# Altium project Line Coding Transceiver_Decoder.PrjPcb
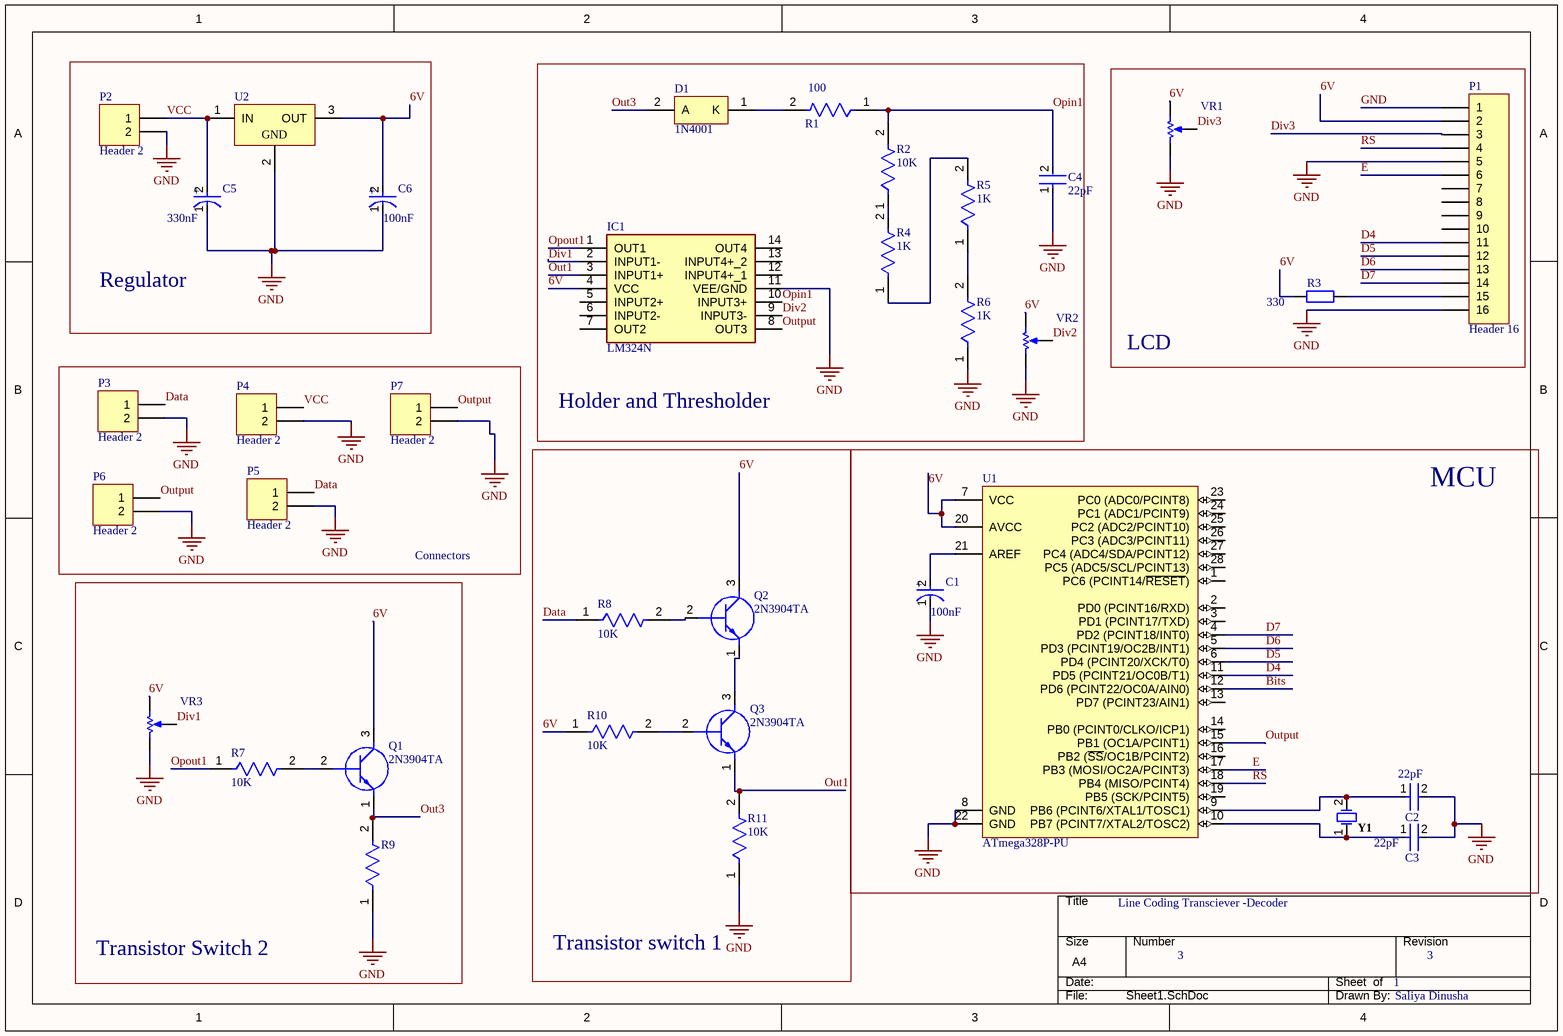
[diagram p0: Sheet1.SchDoc]
1 sheet, 35 parts. Net scope: global (net labels, ports and power ports of the same name join across sheets).
Board file: PCB1.PcbDoc

## Sheet Sheet1.SchDoc: Line Coding Transciever -Decoder
size A4; Author: Saliya Dinusha; SheetNumber: 1; SheetTotal: 1; Project: Line Coding Transciever; RevNumber: 3; VerNumber: 3

### Parts
C1  Capacitance: 100nF  [FP-UVR2AR22MDD1TD-MFG]  (hidden comment: UVR2AR22MDD1TD)
C2  22pF  [FP-RDE0M1-MFG]
C3  22pF  [FP-RDE0M1-MFG]
C4  22pF  [FP-RDE0M1-MFG]
C5  Capacitance: 330nF  [FP-UVR2AR22MDD1TD-MFG]  (hidden comment: UVR2AR22MDD1TD)
C6  Capacitance: 100nF  [FP-UVR2AR22MDD1TD-MFG]  (hidden comment: UVR2AR22MDD1TD)
D1  1N4001  [ONSC-AXIAL_LEAD-2-59-10_P]
IC1  LM324N  [DIP794W56P254L1918H533Q14N]
P1  Header 16  [HDR1X16]
P2  Header 2  [HDR1X2]
P3  Header 2  [HDR1X2]
P4  Header 2  [HDR1X2]
P5  Header 2  [HDR1X2]
P6  Header 2  [HDR1X2]
P7  Header 2  [HDR1X2]
Q1  2N3904TA  [BC33740TA]
Q2  2N3904TA  [BC33740TA]
Q3  2N3904TA  [BC33740TA]
R1  100  [FP-MFR-25-MFG]
R2  10K  [FP-MFR-25-MFG]
R3  value 330  [AXIAL-0.4]  (hidden comment: Res2)
R4  1K  [FP-MFR-25-MFG]
R5  1K  [FP-MFR-25-MFG]
R6  1K  [FP-MFR-25-MFG]
R7  10K  [FP-MFR-25-MFG]
R8  10K  [FP-MFR-25-MFG]
R9  10K  [FP-MFR-25-MFG]  (value not drawn)
R10  10K  [FP-MFR-25-MFG]
R11  10K  [FP-MFR-25-MFG]
U1  ATmega328P-PU  [28P3]
U2  L7805CV  [TO220]  (value not drawn)
VR1  3362P-1-103LF  [BOUR-3362P]  (value not drawn)
VR2  3362P-1-103LF  [BOUR-3362P]  (value not drawn)
VR3  3362P-1-103LF  [BOUR-3362P]  (value not drawn)
Y1  FOXSLF/120-20  [FOX-FOXSLF-2_V]  (value not drawn)

### Blocks framed on the sheet
Regulator: C5 C6 P2 U2
Holder and Thresholder: C4 D1 IC1 R1 R2 R4-R6 VR2
LCD: P1 R3 VR1
Connectors: P3-P7
Transistor switch 1: Q2 Q3 R8 R10 R11
MCU: C1-C3 U1 Y1
Transistor Switch 2: Q1 R7 R9 VR3

### Nets
GND: C1.1(C) C2.2 C3.2 C4.1 C5.1(C) C6.1(C) IC1.11(VEE/GND) P1.1 P1.5 P1.16 P2.2 P3.2 P4.2 P5.2 P6.2 P7.2 R6.1 R9.1 R11.1 U1.8(GND) U1.22(GND) U2.2(GND) VR1.3(CW) VR2.3(CW) VR3.3(CW)
6V: C6.2(A) IC1.4(VCC) P1.2 Q1.3(C) Q2.3(C) R3.1 R10.1 U1.7(VCC) U1.20(AVCC) U2.3(OUT) VR1.1(CCW) VR2.1(CCW) VR3.1(CCW)
Bits: U1.12(PD6_(PCINT22/OC0A/AIN0))
D4: P1.11 U1.11(PD5_(PCINT21/OC0B/T1))
D5: P1.12 U1.6(PD4_(PCINT20/XCK/T0))
D6: P1.13 U1.5(PD3_(PCINT19/OC2B/INT1))
D7: P1.14 U1.4(PD2_(PCINT18/INT0))
Data: P3.1 P5.1 R8.1
Div1: IC1.2(INPUT1-) VR3.2(S)
Div2: IC1.9(INPUT3-) VR2.2(S)
Div3: P1.3 VR1.2(S)
E: P1.6 U1.17(PB3_(MOSI/OC2A/PCINT3))
Opin1: C4.2 IC1.10(INPUT3+) R1.1 R2.2
Opout1: IC1.1(OUT1) R7.1
Out1: IC1.3(INPUT1+) Q3.1(E) R11.2
Out3: D1.2(A) Q1.1(E) R9.2
Output: IC1.8(OUT3) P6.1 P7.1 U1.15(PB1_(OC1A/PCINT1))
RS: P1.4 U1.18(PB4_(MISO/PCINT4))
VCC: C5.2(A) P2.1 P4.1 U2.1(IN)
NetC1_2: C1.2(A) U1.21(AREF)
NetC2_1: C2.1 U1.9(PB6_(PCINT6/XTAL1/TOSC1)) Y1.2
NetC3_1: C3.1 U1.10(PB7_(PCINT7/XTAL2/TOSC2)) Y1.1
NetD1_1: D1.1(K) R1.2
NetP1_15: P1.15 R3.2
NetQ1_2: Q1.2(B) R7.2
NetQ2_1: Q2.1(E) Q3.3(C)
NetQ2_2: Q2.2(B) R8.2
NetQ3_2: Q3.2(B) R10.2
NetR2_1: R2.1 R4.2
NetR4_1: R4.1 R5.2
NetR5_1: R5.1 R6.2

Not connected (* = marked no-connect by the designer): IC1 5(INPUT2+) 6(INPUT2-) 7(OUT2) 12(INPUT4+_1) 13(INPUT4+_2) 14(OUT4); P1 7 8 9 10; U1 1(PC6_(PCINT14/~{RESET})) 2(PD0_(PCINT16/RXD)) 3(PD1_(PCINT17/TXD)) 13(PD7_(PCINT23/AIN1)) 14(PB0_(PCINT0/CLKO/ICP1)) 16(PB2_(~{SS}/OC1B/PCINT2)) 19(PB5_(SCK/PCINT5)) 23(PC0_(ADC0/PCINT8)) 24(PC1_(ADC1/PCINT9)) 25(PC2_(ADC2/PCINT10)) 26(PC3_(ADC3/PCINT11)) 27(PC4_(ADC4/SDA/PCINT12)) 28(PC5_(ADC5/SCL/PCINT13))

### Notes on the sheet
- THIS DOCUMENT AND THE DATA DISCLOSED HEREIN OR
- HEREWITH IS THE PROPERTY OF ALTIUM LIMITED AND MAY
- DWG NO:
- REVISION
- REV:
- DESCRIPTION
- DATE
- APPROVED
- BE FREELY DISTRIBUTED IN WHOLE. NO RIGHTS ARE
- RESERVED OR EXPRESS OR IMPLIED WARANTEE GIVEN.
- ENG:
- APPROVALS
- PROJECT
- DSN:
- CHK:
- REFERENCE DOCUMENTS
- PROJECT REVISION:
- TITLE
- DOCUMENT REVISION:
- DESIGN ITEM:
- BOM:
- FAB DWG:
- PCB DWG:
- ASSY DWG:
- SCALE:
- A3
- SIZE
- CAGE CODE
- FILE NAME
- DWG NO.
- SHEET
- OF
- REV
- (in symbol CMP-12462-000035-1) +

### Library data of the parts
C1 C5 C6 = CMP-12462-000035-1: CAP ALUM 0.22UF 20% 100V RADIAL; Ripple Current: 4.7mA; Life (Hours): 2000Hour; Dielectric Material: Aluminium; Dissipation Factor: 0.08%; Lead/Base Style: Straight; Series: VR; Length: 11mm; Package Quantity: 2000; Height - Seated (Max): 0.492inch; Termination: Radial; Height: 11mm; Tolerance: 20%; Voltage Rating (DC): 100V; Min Operating Temperature: -40°C; Voltage Rating: 100V; RoHS Compliant: Yes; Mount: Through Hole; REACH SVHC: No SVHC; Case/Package: Radial; Diameter: 5mm; Packaging: Tape and Reel; Lead Pitch: 2mm; Max Operating Temperature: 85°C
C2-C4 = CMP-06035-051680-1: Ceramic Capacitor 100nF ±10% 50V X7R Radial; Lead/Base Style: Kinked; Lead Diameter: 0.5mm; Lead Free: Lead Free; Mount: Through Hole; Package Quantity: 2000; Lead Pitch: 0.197inch; Capacitance: 22pF; Case/Package: Radial; Tolerance: 10%; Height - Seated (Max): 0.236inch; Max Operating Temperature: 125°C; Dielectric: X7R; Min Operating Temperature: -55°C; Voltage Rating (DC): 50V; Voltage Rating: 50V; Termination: Radial; Height: 3.5mm; Resistor Type: Ceramic; Width: 3.5mm; Packaging: Tape and Reel; Length: 0.157inch
D1 = CMP-0902-00117-1: Standard Recovery Rectifier, 2-Pin Axial_Lead, Pb-Free, Bulk Bag; Manufacturer: On Semiconductor; VRRM Max (V): 50; IFSM Max (A): 30; IO(rec) Max (A): 1; ComponentLink3URL: http://www.onsemi.cn/pub_link/Collateral/59-10.PDF; ComponentLink3Description: Package Specification; PartNumber: 1N4001; PackageVersion: Rev. U, 02/2005; Packing: Bulk Bag; ComponentLink2Description: Datasheet; RoHS: TRUE; DatasheetVersion: Rev. 13; PackageReference: AXIAL_LEAD-2-59-10; ComponentLink1URL: http://www.onsemi.com/; Mounting Technology: Through Hole; PackageDescription: 2-Pin, Axial Lead, Diameter 2.35 mm; ComponentLink2URL: http://www.onsemi.com/pub_link/Collateral/1N4001-D.PDF; Type: Standard Recovery; ComponentLink1Description: Manufacturer URL
IC1 = LM324N: Integrated Circuit; Manufacturer_Name: ON Semiconductor; Datasheet Link: http://www.onsemi.com/pub/Collateral/LM324-D.PDF; Height: 5.33mm; Manufacturer_Part_Number: LM324N; Mouser Part Number: 512-LM324N; Mouser Price/Stock: https://www.mouser.co.uk/ProductDetail/ON-Semiconductor-Fairchild/LM324N?qs=KwzQVQ%2FCbKb0cbfnXIrdrA%3D%3D; Arrow Part Number: LM324N; Arrow Price/Stock: https://www.arrow.com/en/products/lm324n/on-semiconductor
P1 = Header 16: Header, 16-Pin; LatestRevisionDate: 17-Jul-2002; LatestRevisionNote: Re-released for DXP Platform.; Publisher: Altium Limited
P2-P7 = Header 2: Header, 2-Pin; LatestRevisionDate: 17-Jul-2002; LatestRevisionNote: Re-released for DXP Platform.; Publisher: Altium Limited
Q1-Q3 = 2N3904TA: Transistor BJT NPN; Manufacturer_Name: ON Semiconductor; Datasheet Link: http://www.onsemi.com/pub/Collateral/2N3904-D.pdf; Manufacturer_Part_Number: 2N3904TA; Mouser Part Number: 512-2N3904TA; Mouser Price/Stock: https://www.mouser.co.uk/ProductDetail/ON-Semiconductor-Fairchild/2N3904TA?qs=ljbEvF4DwOOn1Ev%2FzRYaoA%3D%3D; Arrow Part Number: 2N3904TA; Arrow Price/Stock: https://www.arrow.com/en/products/2n3904ta/on-semiconductor?region=nac
R1 = CMP-03413-000001-1: RES 1.18K OHM 1/4W 1% AXIAL; Manufacturer: Yageo; Manufacturer Part Number: MFR-25FBF52-1K18; Value: 100Ω; Temperature Coefficient: 100ppm/°C; Power Rating: 0.25W; Voltage Rating: 250V; Resistance: 1.18kΩ; Temperature: -55°C to +155°C; Automotive: No; Temperature Range High: +155°C; Mouser Description: Metal Film Resistors 1.18K OHM 1/4W 1%; Digikey Description: RES 1.18K OHM 1/4W 1% AXIAL; Lead Free: Yes; Tolerance: 1%; ComponentLink2Description: Datasheet; ComponentLink2URL: https://www.yageo.com/upload/media/product/products/datasheet/lr/Yageo_LR_MFR_1.pdf; Temperature Range Low: -55°C; Package: MFR-25; Ipc Land Pattern Name: RESAD1000W75L680D260; Composition: Metal Film; Category: Res; Octopart: https://octopart.com/mfr-25fbf52-1k18-yageo-56251681; Series: MFR; Device Class L2: Resistors; Height: 2.6mm; Device Class L3: Through-Hole Resistors; RoHS: TRUE; Device Class L1: Passive Components
R2 R4-R8 R10 R11 = CMP-03413-000001-1: RES 1.18K OHM 1/4W 1% AXIAL; Manufacturer: Yageo; Manufacturer Part Number: MFR-25FBF52-1K18; Value: 1.18kΩ; Temperature Coefficient: 100ppm/°C; Power Rating: 0.25W; Voltage Rating: 250V; Temperature: -55°C to +155°C; Automotive: No; Temperature Range High: +155°C; Mouser Description: Metal Film Resistors 1.18K OHM 1/4W 1%; Digikey Description: RES 1.18K OHM 1/4W 1% AXIAL; Lead Free: Yes; Tolerance: 1%; ComponentLink2Description: Datasheet; ComponentLink2URL: https://www.yageo.com/upload/media/product/products/datasheet/lr/Yageo_LR_MFR_1.pdf; Temperature Range Low: -55°C; Package: MFR-25; Ipc Land Pattern Name: RESAD1000W75L680D260; Composition: Metal Film; Category: Res; Octopart: https://octopart.com/mfr-25fbf52-1k18-yageo-56251681; Series: MFR; Device Class L2: Resistors; Height: 2.6mm; Resistance: 1.18kΩ; Device Class L3: Through-Hole Resistors; RoHS: TRUE; Device Class L1: Passive Components
R3 = Res2: Resistor; Published: 8-Jun-2000; LatestRevisionDate: 17-Jul-2002; LatestRevisionNote: Re-released for DXP Platform.; PackageReference: AXIAL-0.4; Publisher: Altium Limited; PackageDescription: Axial Device, Thru-Hole; 2 Leads; 0.4 in Pin Spacing
R9 = CMP-03413-000001-1: RES 1.18K OHM 1/4W 1% AXIAL; Manufacturer: Yageo; Manufacturer Part Number: MFR-25FBF52-1K18; Temperature Coefficient: 100ppm/°C; Power Rating: 0.25W; Voltage Rating: 250V; Resistance: 1.18kΩ; Temperature: -55°C to +155°C; Automotive: No; Value: 10K; Temperature Range High: +155°C; Mouser Description: Metal Film Resistors 1.18K OHM 1/4W 1%; Digikey Description: RES 1.18K OHM 1/4W 1% AXIAL; Lead Free: Yes; Tolerance: 1%; ComponentLink2Description: Datasheet; ComponentLink2URL: https://www.yageo.com/upload/media/product/products/datasheet/lr/Yageo_LR_MFR_1.pdf; Temperature Range Low: -55°C; Package: MFR-25; Ipc Land Pattern Name: RESAD1000W75L680D260; Composition: Metal Film; Category: Res; Octopart: https://octopart.com/mfr-25fbf52-1k18-yageo-56251681; Series: MFR; Device Class L2: Resistors; Height: 2.6mm; Device Class L3: Through-Hole Resistors; RoHS: TRUE; Device Class L1: Passive Components
U1 = CMP-0095-00013-2: 8-bit AVR Microcontroller, 32KB Flash, 1KB EEPROM, 2KB SRAM, 28-pin PDIP, Industrial Grade (-40°C to 85°C); RevisionNote: DatasheetVersion updated. URLs added.; PackageVersion: revB, Sep-2001; PackageDescription: 28-lead (0.300"/7.62mm Wide) Plastic Dual Inline Package (PDIP); DatasheetVersion: revD, May-2011; ComponentLink1Description: Manufacturer URL; ComponentLink1URL: http://www.atmel.com/; PackageReference: 28P3; ComponentLink2Description: ATmega48A/48PA/88A/88PA/168A/168PA/328/328P Datasheet; ComponentLink3URL: http://www.atmel.com/dyn/resources/prod_documents/8271S.pdf; ComponentLink2URL: http://www.atmel.com/dyn/resources/prod_documents/8271.pdf; ComponentLink3Description: ATmega48A/48PA/88A/88PA/168A/168PA/328/328P Summary
U2 = CMP-0244-00483-1: Positive Voltage Regulator, 5V, 3-Pin TO-220; PackageDescription: TO, Thru-Hole, Vertical, Heatsink Mounted; 3 In-Line Leads; Pitch 2.54 mm; ComponentLink2Description: Datasheet; PackageReference: TO220; ComponentLink3URL: http://www.st.com/internet/com/TECHNICAL_RESOURCES/TECHNICAL_LITERATURE/PACKAGE_INFORMATION/CD00004649.pdf; DatasheetVersion: 16/11/2011; ComponentLink1Description: Manufacturer URL; ComponentLink1URL: http://www.st.com; PackageVersion: ver3.0; ComponentLink3Description: Package Specification; ComponentLink2URL: http://www.st.com/internet/com/TECHNICAL_RESOURCES/TECHNICAL_LITERATURE/DATASHEET/CD00000444.pdf
VR1-VR3 = CMP-1747-00004-1: Square Trimpot(R) Trimming Potentiometer, 10 KOhm, 300 V, -55 to 125 degC, 3-Pin THD, RoHS, Tube; Voltage Rating: 220 mV; Power Rating: 1 W; Tolerance: 1%; Resistance: 50 mohm; Case/Package: 1206; Length: 3.2 mm; RoHSCompliant: True; PackageDescription: 3-Pin Through Hole Device, Body 6.6 x 6.99 mm, Pitch 2.54 mm; ComponentLink2Description: Datasheet; REACH SVHC: No SVHC; Mount: Surface Mount; Height: 0.6 mm; Packaging: Tape and Reel; ComponentLink1URL: http://www.bourns.com/; Case Code (Imperial): 0612; Pins: 2; Case Code (Metric): 1632; ComponentLink2URL: http://www.bourns.com/docs/Product-Datasheets/3362.pdf; Min Operating Temperature: -25degC; ComponentLink1Description: Manufacturer URL; PackageReference: 3326P; Max Operating Temperature: 125degC; Width: 1.6 mm; Package Quantity: 5000; DatasheetVersion: May-16
Y1 = CMP-1749-00004-1: Resistance Weld Thru-Hole Crystal, 12 MHz, +/-30 ppm, -20 to 70 degC, 2-Pin THD, RoHS, Bulk; Elements: 1; Rds On Max: 115 mohm; Typical Rise Time: 90 ns; Max Power Dissipation: 2.5 W; Case\Package: TO-251-3; Input Capacitance: 350 pF; REACH SVHC: No SVHC; Length: 6.6 mm; ComponentLink1URL: http://www.foxonline.com/; PackageDescription: 2-Pin Through Hole Device, Body 11.35 x 4.65 mm, Pitch 4.88 mm; Radiation Hardening: No; Package Quantity: 70; Packaging: Rail/Tube; ComponentLink1Description: Manufacturer URL; Min Operating Temperature: -55 degC; Max Operating Temperature: 150 degC; RoHSCompliant: true; PackageReference: FOXSLF-2; DatasheetVersion: Mar-15; Pins: 3; Height: 6.1 mm; Mount: Through Hole; ComponentLink2URL: http://www.foxonline.com/pdfs/hc49slf.pdf; ComponentLink2Description: Datasheet; Width: 2.3 mm